# EAGLE design controller (EAGLE 6.1)
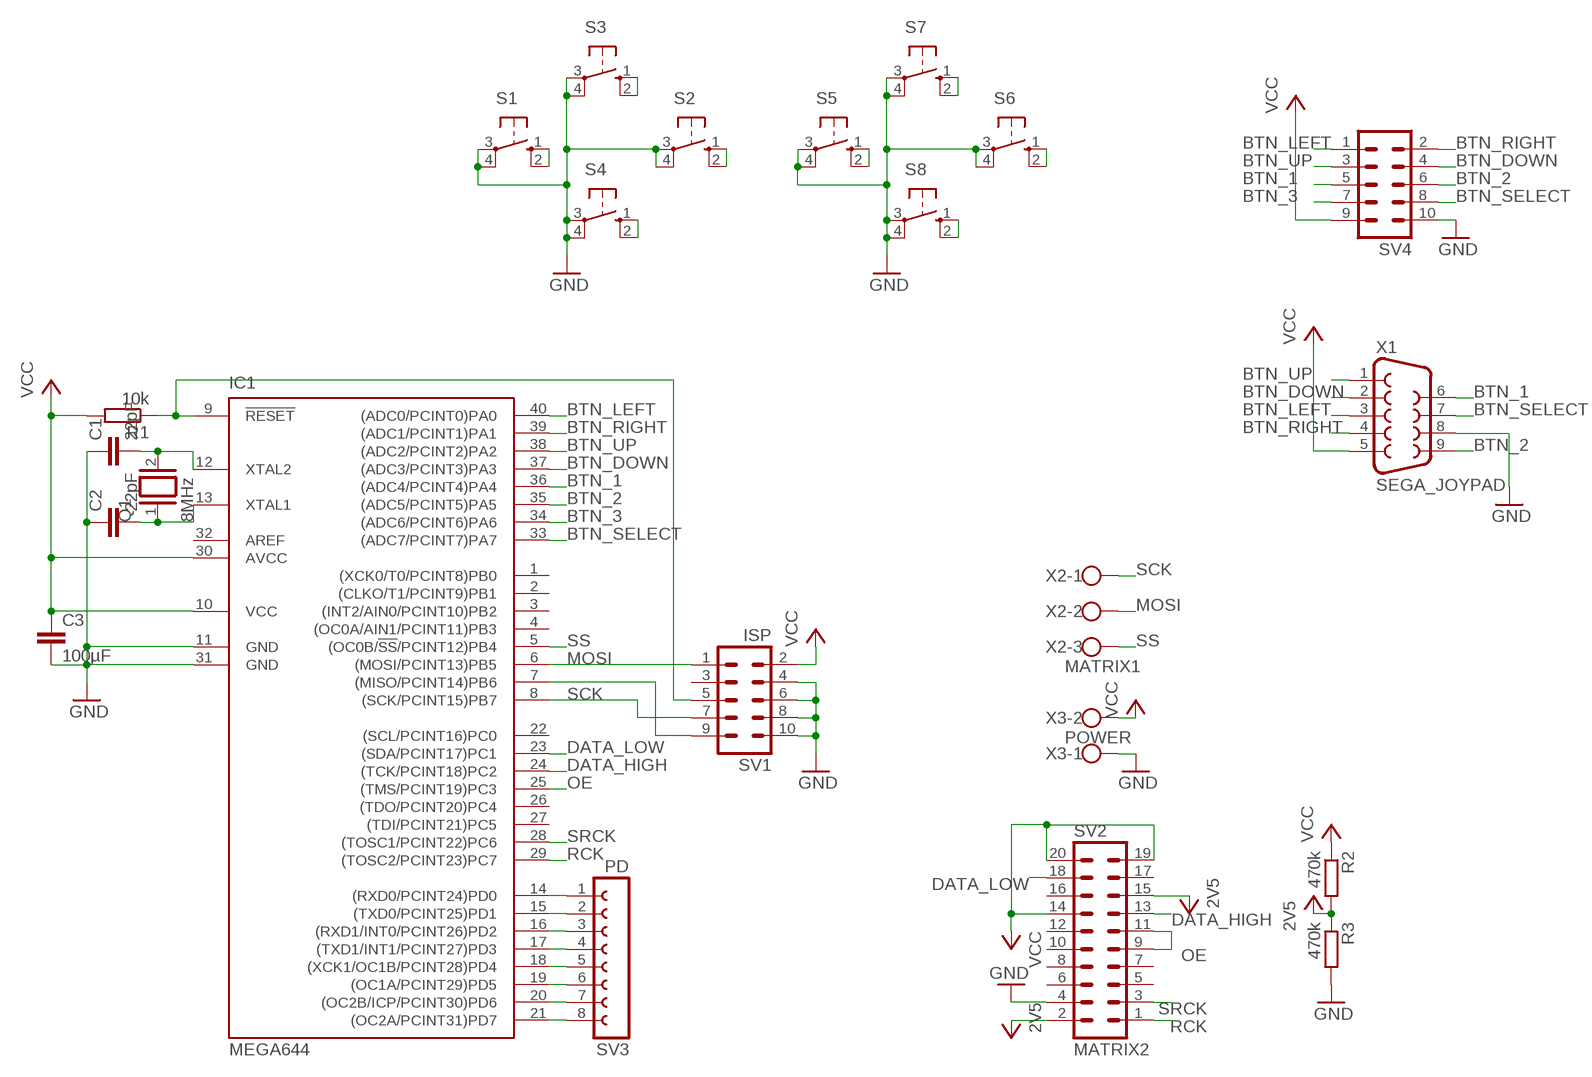
[diagram p0: schematic, sheet 1]

## Parts
C1  22pF  C-EU050-024X044  [C050-024X044]
C2  22pF  C-EU050-024X044  [C050-024X044]
C3  100µF  C-EU050-030X075  [C050-030X075]
IC1  MEGA644  MEGA164P/324P/644P-PU  [DIL40]
Q1  8MHz  XTAL/S  [QS]
R1  10k  R-EU_0207/10  [0207/10]
R2  470k  R-EU_0207/10  [0207/10]
R3  470k  R-EU_0207/10  [0207/10]
S1  10-XX  [B3F-10XX]
S2  10-XX  [B3F-10XX]
S3  10-XX  [B3F-10XX]
S4  10-XX  [B3F-10XX]
S5  10-XX  [B3F-10XX]
S6  10-XX  [B3F-10XX]
S7  10-XX  [B3F-10XX]
S8  10-XX  [B3F-10XX]
SV1  ISP  ML10  [ML10]
SV2  MATRIX2  ML20  [ML20]
SV3  PD  FE08-1  [FE08]
SV4  ML10  [ML10]
X1  SEGA_JOYPAD  F09HP  [F09HP]
X2  MATRIX1  W237-103  [W237-103]
X3  POWER  W237-102  [W237-102]

## Nets
+3V3: R2.2 R3.1 SV2.2 SV2.15 ; supply symbol labelled 2V5
BTN_1: IC1.36((ADC4/PCINT4)PA4) S7.1(S) S7.2(S1) SV4.5 X1.6
BTN_2: IC1.35((ADC5/PCINT5)PA5) S5.1(S) S5.2(S1) SV4.6 X1.9
BTN_3: IC1.34((ADC6/PCINT6)PA6) S6.1(S) S6.2(S1) SV4.7
BTN_DOWN: IC1.37((ADC3/PCINT3)PA3) S4.1(S) S4.2(S1) SV4.4 X1.2
BTN_LEFT: IC1.40((ADC0/PCINT0)PA0) S1.1(S) S1.2(S1) SV4.1 X1.3
BTN_RIGHT: IC1.39((ADC1/PCINT1)PA1) S2.1(S) S2.2(S1) SV4.2 X1.4
BTN_SELECT: IC1.33((ADC7/PCINT7)PA7) S8.1(S) S8.2(S1) SV4.8 X1.7
BTN_UP: IC1.38((ADC2/PCINT2)PA2) S3.1(S) S3.2(S1) SV4.3 X1.1
DATA_HIGH: SV2.13
DATA_LOW: SV2.18
GND: C1.1 C2.1 C3.2 IC1.11(GND) IC1.31(GND) R3.2 S1.3(P) S1.4(P1) S2.3(P) S2.4(P1) S3.3(P) S3.4(P1) S4.3(P) S4.4(P1) S5.3(P) S5.4(P1) S6.3(P) S6.4(P1) S7.3(P) S7.4(P1) S8.3(P) S8.4(P1) SV1.4 SV1.6 SV1.8 SV1.10 SV2.4 SV4.10 X1.8 X3.1
MOSI: IC1.6((MOSI/PCINT13)PB5) SV1.1 X2.2
N$2: C2.2 IC1.13(XTAL1) Q1.1
N$3: C1.2 IC1.12(XTAL2) Q1.2
N$4: IC1.9(!RESET) R1.1 SV1.5
N$5: IC1.14((RXD0/PCINT24)PD0) SV3.1
N$6: IC1.7((MISO/PCINT14)PB6) SV1.9
N$7: IC1.15((TXD0/PCINT25)PD1) SV3.2
N$8: IC1.16((RXD1/INT0/PCINT26)PD2) SV3.3
N$9: IC1.17((TXD1/INT1/PCINT27)PD3) SV3.4
N$10: IC1.18((XCK1/OC1B/PCINT28)PD4) SV3.5
N$11: IC1.19((OC1A/PCINT29)PD5) SV3.6
N$12: IC1.20((OC2B/ICP/PCINT30)PD6) SV3.7
N$13: IC1.21((OC2A/PCINT31)PD7) SV3.8
OE: SV2.9 SV2.11
RCK: IC1.29((TOSC2/PCINT23)PC7) SV2.1
SCK: IC1.8((SCK/PCINT15)PB7) SV1.7 X2.1
SRCK: IC1.28((TOSC1/PCINT22)PC6) SV2.3
SS: IC1.5((OC0B/!SS!/PCINT12)PB4) X2.3
VCC: C3.1 IC1.10(VCC) IC1.30(AVCC) R1.2 R2.1 SV1.2 SV2.14 SV2.19 SV2.20 SV4.9 X1.5 X3.2
Unconnected: IC1.1((XCK0/T0/PCINT8)PB0) IC1.2((CLKO/T1/PCINT9)PB1) IC1.3((INT2/AIN0/PCINT10)PB2) IC1.4((OC0A/AIN1/PCINT11)PB3) IC1.22((SCL/PCINT16)PC0) IC1.23((SDA/PCINT17)PC1) IC1.24((TCK/PCINT18)PC2) IC1.25((TMS/PCINT19)PC3) IC1.26((TDO/PCINT20)PC4) IC1.27((TDI/PCINT21)PC5) SV1.3 SV2.5 SV2.6 SV2.7 SV2.8 SV2.10 SV2.12 SV2.16 SV2.17

## Power pins joined to a net without a drawn wire
AREF: IC1.32(AREF)

## Library data of the parts
C1-C3 = resistor:C-EU: CAPACITOR, European symbol
IC1 = avr-5:MEGA164P/324P/644P-PU
Q1 = special:XTAL/S: CRYSTAL
R1-R3 = resistor:R-EU_: RESISTOR, European symbol
S1-S8 = switch-omron:10-XX: OMRON SWITCH; MPN: B3F-1000; OC_FARNELL: 176432; OC_NEWARK: 36M3542
SV1 = con-ml:ML10: HARTING; OC_FARNELL: unknown; OC_NEWARK: unknown
SV2 = con-ml:ML20: HARTING; OC_FARNELL: unknown; OC_NEWARK: unknown
SV3 = con-lsta:FE08-1: FEMALE HEADER; OC_FARNELL: unknown; OC_NEWARK: unknown
SV4 = con-harting-ml:ML10: HARTING; OC_FARNELL: unknown; OC_NEWARK: unknown
X1 = con-subd:F09: SUB-D; OC_FARNELL: unknown; OC_NEWARK: unknown
X2 = con-wago-500:W237-103: WAGO SCREW CLAMP; MPN: 237-103; OC_FARNELL: unknown; OC_NEWARK: 18M7116
X3 = con-wago-500:W237-102: WAGO SCREW CLAMP; MPN: 237-102; OC_FARNELL: unknown; OC_NEWARK: 70K9898

## Board
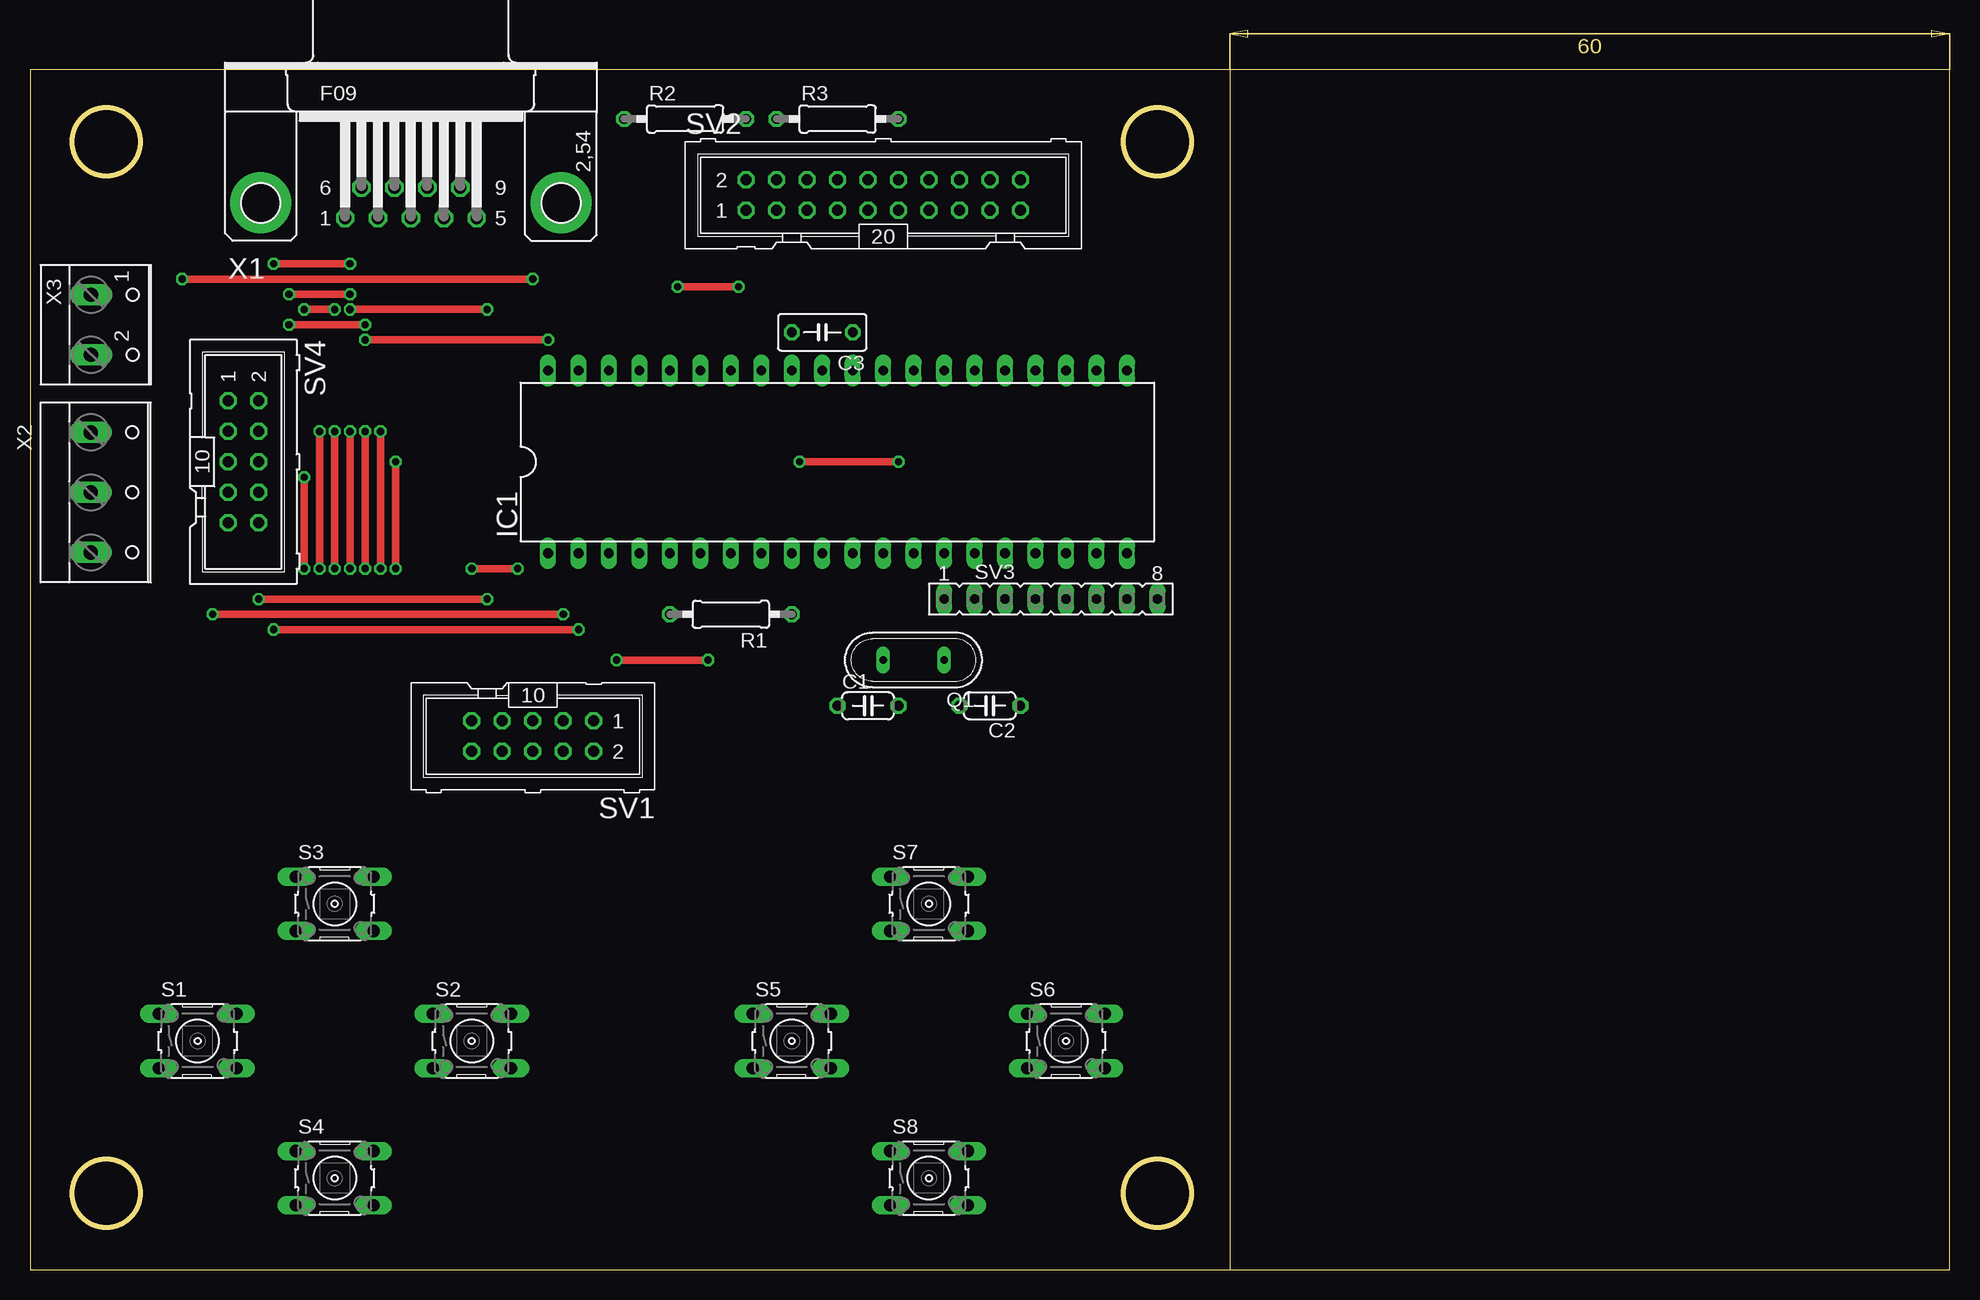
[diagram p1: board, top side]
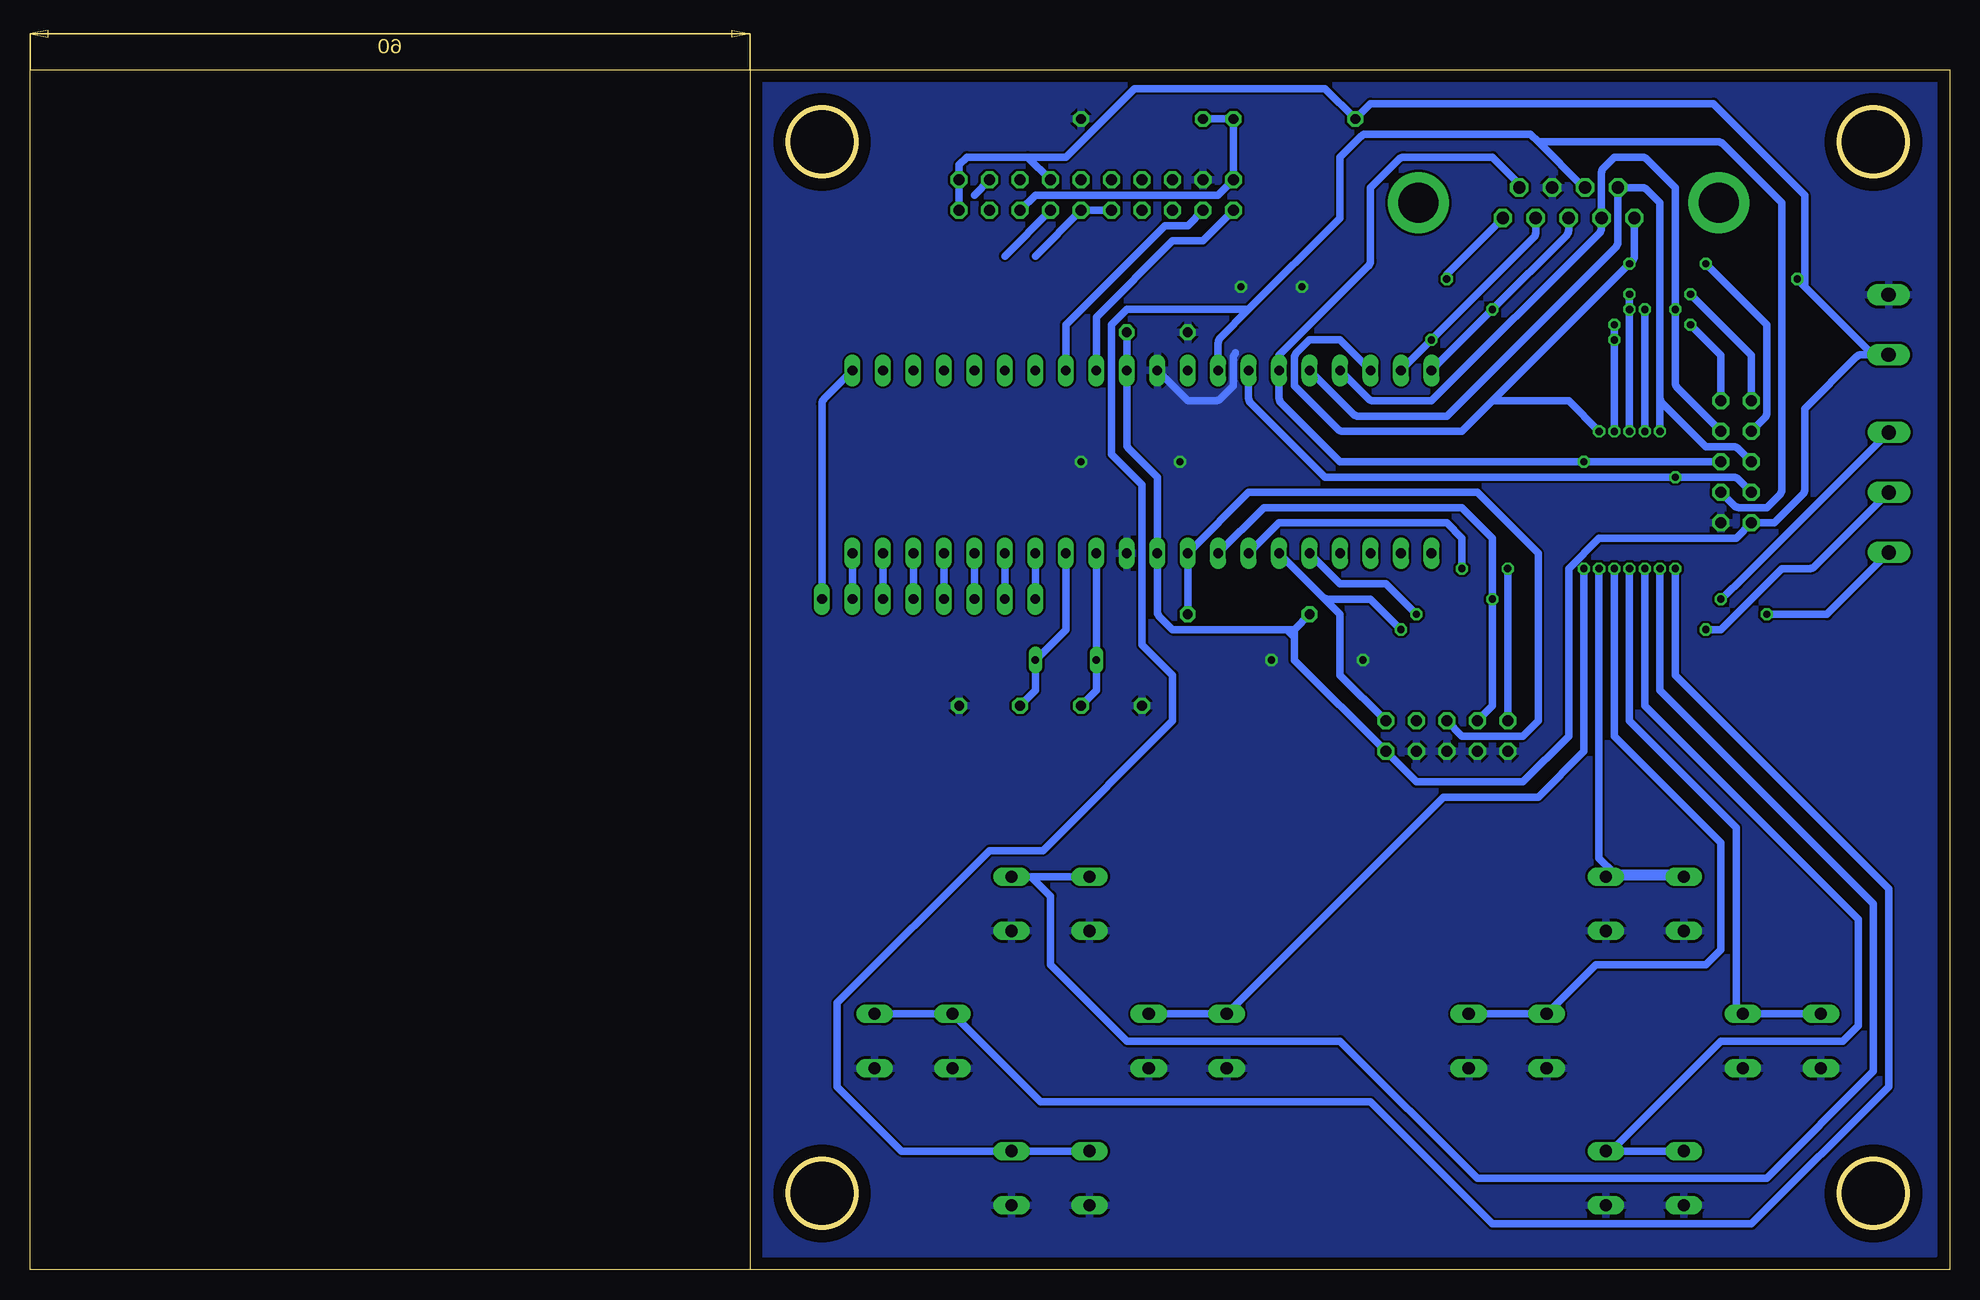
[diagram p2: board, bottom side, seen from below]

Size 160 x 100 mm. Coordinates in mm from the lower left corner, seen from the top.
Outline: 100,0 0,0 0,100 100,100
Outline: 100,0 160,0 160,100 100,100
Outline: 100,100 100,0
Outline: circle at 6.35,93.98 radius 2.84
Outline: circle at 6.35,6.35 radius 2.84
Outline: circle at 93.98,93.98 radius 2.84
Outline: circle at 93.98,6.35 radius 2.84
Copper layers (1*16): Top 0.035mm / dielectric 1.5mm / Bottom 0.035mm
Design rules: minimum track width 10mil, minimum drill 24mil, track to track 8mil, track to pad 8mil, pad to pad 8mil, via to via 8mil, smd to smd 8mil, copper to edge 40mil, drill to drill 8mil, minimum pad ring 10mil, minimum via ring 8mil, stop-mask expansion 4mil, vias tented up to drill 0mil, thermal gap 10mil

### Footprints (pad centres in the part's own frame; a part is rotated, then mirrored left to right if it is on the bottom)
C050-024X044 = drill 0.813 octagon: 1 -2.54,0; 2 2.54,0
C050-030X075 = drill 0.813 octagon: 1 -2.54,0; 2 2.54,0
DIL40 = drill 0.813 long: 1 -24.13,-7.62; 2 -21.59,-7.62; 3 -19.05,-7.62; 4 -16.51,-7.62; 5 -13.97,-7.62; 6 -11.43,-7.62; 7 -8.89,-7.62; 8 -6.35,-7.62; 9 -3.81,-7.62; 10 -1.27,-7.62; 11 1.27,-7.62; 12 3.81,-7.62; 13 6.35,-7.62; 14 8.89,-7.62; 15 11.43,-7.62; 16 13.97,-7.62; 17 16.51,-7.62; 18 19.05,-7.62; 19 21.59,-7.62; 20 24.13,-7.62; 21 24.13,7.62; 22 21.59,7.62; 23 19.05,7.62; 24 16.51,7.62; 25 13.97,7.62; 26 11.43,7.62; 27 8.89,7.62; 28 6.35,7.62; 29 3.81,7.62; 30 1.27,7.62; 31 -1.27,7.62; 32 -3.81,7.62; 33 -6.35,7.62; 34 -8.89,7.62; 35 -11.43,7.62; 36 -13.97,7.62; 37 -16.51,7.62; 38 -19.05,7.62; 39 -21.59,7.62; 40 -24.13,7.62
QS = drill 0.61 long: 1 -2.54,0; 2 2.54,0
0207/10 = drill 0.813 octagon: 1 -5.08,0; 2 5.08,0
B3F-10XX = drill 1.016 long: 1 -3.251,2.261; 2 3.251,2.261; 3 -3.251,-2.261; 4 3.251,-2.261
ML10 = drill 0.914 octagon: 1 -5.08,-1.27; 2 -5.08,1.27; 3 -2.54,-1.27; 4 -2.54,1.27; 5 0,-1.27; 6 0,1.27; 7 2.54,-1.27; 8 2.54,1.27; 9 5.08,-1.27; 10 5.08,1.27
ML20 = drill 0.914 octagon: 1 -11.43,-1.27; 2 -11.43,1.27; 3 -8.89,-1.27; 4 -8.89,1.27; 5 -6.35,-1.27; 6 -6.35,1.27; 7 -3.81,-1.27; 8 -3.81,1.27; 9 -1.27,-1.27; 10 -1.27,1.27; 11 1.27,-1.27; 12 1.27,1.27; 13 3.81,-1.27; 14 3.81,1.27; 15 6.35,-1.27; 16 6.35,1.27; 17 8.89,-1.27; 18 8.89,1.27; 19 11.43,-1.27; 20 11.43,1.27
FE08 = drill 0.813 long: 1 -8.89,0; 2 -6.35,0; 3 -3.81,0; 4 -1.27,0; 5 1.27,0; 6 3.81,0; 7 6.35,0; 8 8.89,0
F09HP = drill 1.016 octagon: 1 -5.486,-1.27; 2 -2.743,-1.27; 3 0,-1.27; 4 2.743,-1.27; 5 5.486,-1.27; 6 -4.115,1.27; 7 -1.372,1.27; 8 1.372,1.27; 9 4.115,1.27 | drill 3.302 pad 5.08: G1 -12.522,0; G2 12.522,0
W237-103 = drill 1.194 long: 1 -5,-1.29; 2 0,-1.29; 3 5,-1.29
W237-102 = drill 1.194 long: 1 -2.5,-1.27; 2 2.5,-1.27

### Placement (x,y rotation side)
C1  69.85,46.99 0 top
C2  80.01,46.99 180 top
C3  66.04,78.11 180 top
IC1  67.31,67.31 0 top
Q1  73.66,50.8 180 top
R1  58.42,54.61 180 top
R2  54.61,95.89 0 top
R3  67.31,95.89 0 top
S1  13.97,19.05 0 top
S2  36.83,19.05 0 top
S3  25.4,30.48 0 top
S4  25.4,7.62 0 top
S5  63.5,19.05 0 top
S6  86.36,19.05 0 top
S7  74.93,30.48 0 top
S8  74.93,7.62 0 top
SV1  41.91,44.45 180 top
SV2  71.12,89.53 0 top
SV3  85.09,55.88 0 top
SV4  17.78,67.31 270 top
X1  31.75,88.9 0 top
X2  6.35,64.77 270 top
X3  6.35,78.74 270 top

### Tracks (layer width: path | path; a pad name or v marks a point on that pad's centre or on a via)
+3V3
  Bottom 0.61: R3.1 R2.2 SV2.2 60.96,89.53 76.2,89.53 SV2.15
BTN_1  (via drill 0.6 pad 0.41)
  Top 0.61: v24.13,58.42 v24.13,69.85
  Bottom 0.61: S7.1 S7.2 76.56,32.74 74.93,31.11 74.93,25.4 68.58,19.05 50.8,19.05 39.37,7.62 15.24,7.62 6.35,16.51 6.35,30.48 24.13,48.26 v24.13,58.42 | IC1.36 49.72,71.31 arc-45 49.27,71.12 41.91,71.12 27.82,85.21 arc-45 27.64,85.66 X1.6 25.66,90.17 arc45 25.21,89.98 24.13,88.9 24.13,72.65 arc-45 23.94,72.2 | SV4.5 17.59,68.39 arc-45 18.04,68.58 20.32,68.58 23.94,72.2 | v24.13,69.85 24.13,72.39 23.94,72.2
BTN_2  (via drill 0.6 pad 0.41)
  Top 0.61: v30.48,58.42 v30.48,67.31
  Bottom 0.61: S5.2 S5.1 42.19,39.37 34.29,39.37 30.48,43.18 v30.48,58.42 | X1.9 35.87,90.21 arc-45 36.05,90.66 38.1,92.71 45.46,92.71 arc-45 45.91,92.52 48.26,90.17 48.26,84.08 arc45 48.45,83.63 55.88,76.2 IC1.35 55.88,72.65 arc-45 55.69,72.2 50.8,67.31 v30.48,67.31 SV4.6
BTN_3  (via drill 0.6 pad 0.41)
  Top 0.61: v22.86,58.42 v22.86,66.04
  Bottom 0.61: S6.2 S6.1 75.77,13.97 48.26,13.97 38.1,3.81 16.51,3.81 5.08,15.24 5.08,31.75 22.86,49.53 v22.86,58.42 | SV4.7 17.59,65.85 arc-45 18.04,66.04 v22.86,66.04 52.07,66.04 58.23,72.2 arc45 58.42,72.65 IC1.34
BTN_DOWN  (via drill 0.6 pad 0.41)
  Top 0.61: v25.4,58.42 v25.4,69.85 | v25.4,80.01 v22.86,80.01
  Bottom 0.61: S4.1 27.94,9.88 | 27.94,9.88 S4.2 | IC1.37 48.45,72.58 arc-45 48,72.39 43.18,72.39 29.19,86.38 arc-45 29.01,86.83 X1.2 29.01,91.38 arc45 28.82,91.83 27.94,92.71 25.66,92.71 arc45 25.21,92.52 22.86,90.17 v22.86,80.01 22.86,73.92 arc-45 22.67,73.47 SV4.4 | v25.4,58.42 25.4,46.99 7.62,29.21 7.62,20.32 8.89,19.05 19.05,19.05 27.94,10.16 27.94,9.88 | v25.4,69.85 v25.4,80.01
BTN_LEFT  (via drill 0.6 pad 0.41)
  Top 0.61: v26.67,58.42 v26.67,69.85 | v21.59,81.28 v26.67,81.28 | v38.1,80.01 v26.67,80.01
  Bottom 0.61: S1.1 S1.2 17.78,21.87 17.78,36.83 26.67,45.72 v26.67,58.42 | IC1.40 v38.1,80.01 31.94,86.17 arc-45 31.75,86.62 X1.3 | SV4.1 16.51,76.2 v21.59,81.28 | v26.67,81.28 v26.67,80.01 v26.67,69.85
BTN_RIGHT  (via drill 0.6 pad 0.41)
  Top 0.61: v21.59,78.74 v27.94,78.74 | v27.94,58.42 v27.94,69.85 | v43.18,77.47 v27.94,77.47
  Bottom 0.61: S2.2 S2.1 29.49,25.4 20.32,25.4 19.05,26.67 19.05,35.56 27.94,44.45 v27.94,58.42 | IC1.39 v43.18,77.47 34.68,85.97 arc-45 34.49,86.42 X1.4 | SV4.2 19.05,76.2 v21.59,78.74 | v27.94,69.85 v27.94,77.47 v27.94,78.74
BTN_SELECT
  Bottom 0.61: S8.1 S8.2 | 34.29,93.98 34.92,94.61 48.63,94.61 arc-45 49.08,94.43 50.8,92.71 50.8,87.63 58.42,80.01 | 34.29,93.98 30.55,90.24 arc-45 X1.7 | 58.42,80.01 60.77,77.66 arc-45 60.96,77.21 IC1.33 | SV4.8 17.97,63.69 arc-45 17.52,63.5 15.24,63.5 14.16,64.58 arc-45 13.97,65.03 13.97,88.9 18.86,93.79 arc-45 19.31,93.98 34.29,93.98 | 76.48,9.88 S8.2 | S8.2 87.35,9.88 92.71,15.24 92.71,22.23 80.01,34.92 75.56,34.92 64.77,45.72 64.77,49.53 67.31,52.07 67.31,65.41 69.85,67.94 69.85,78.74 68.58,80.01 58.42,80.01
BTN_UP  (via drill 0.6 pad 0.41)
  Top 0.61: v20.32,83.82 v26.67,83.82 | v29.21,58.42 v29.21,69.85
  Bottom 0.61: S3.2 S3.1 22.43,33.02 27.94,33.02 29.21,34.29 v29.21,58.42 | IC1.38 50.8,77.47 53.34,77.47 54.42,76.39 arc-45 54.61,75.94 54.61,73.66 50.99,70.04 arc-45 50.54,69.85 40.64,69.85 38.1,72.39 | 38.1,72.39 v26.67,83.82 26.45,84.04 arc-45 26.26,84.49 X1.1 | SV4.3 15.43,70.93 arc-45 15.24,71.38 15.24,78.74 v20.32,83.82 | v29.21,69.85 31.75,72.39 38.1,72.39
DATA_HIGH
  Bottom 0.61: 78.74,84.45 SV2.13
DATA_LOW
  Bottom 0.61: 81.28,89.53 SV2.18
GND  (via drill 0.6, 0.6 pad 0.41)
  Top 0.61: v53.98,81.92 v59.05,81.92 | v48.9,50.8 v56.52,50.8 | v64.14,67.31 v72.39,67.31
  Bottom 0.61: IC1.31 63.5,72.39 61.22,72.39 arc-45 60.77,72.58 59.69,73.66 59.69,75.94 arc45 59.5,76.39
  pour Bottom: 1.27,100.33 99.06,99.69 99.06,1.27 1.27,1.27
MOSI  (via drill 0.6 pad 0.41)
  Top 0.61: v20.32,53.34 v45.72,53.34
  Bottom 0.61: IC1.6 53.34,57.15 52.26,56.07 | 52.26,56.07 arc-45 51.81,55.88 | 51.81,55.88 48.26,55.88 v45.72,53.34 | X2.2 11.22,58.61 arc45 11.67,58.42 13.97,58.42 19.05,53.34 v20.32,53.34 | SV1.1 50.8,49.53 50.8,54.61 51.81,55.62 | 51.81,55.62 51.81,55.88 | 52.26,56.07 51.81,55.62
N$2
  Bottom 0.61: IC1.13 73.66,53.34 Q1.1 76.2,48.26 C2.2
N$3
  Bottom 0.61: IC1.12 Q1.2 71.12,48.26 C1.2
N$4
  Bottom 0.61: 63.5,59.43 R1.1 IC1.9 | 63.31,59.88 58.42,64.77 39.37,64.77 34.29,59.69 34.29,45.72 35.56,44.45 40.64,44.45 SV1.5 | 63.31,59.88 arc-45 63.5,59.43 | 63.5,59.43 IC1.9 | 63.31,59.88 IC1.9
N$5
  Bottom 0.61: SV3.1 IC1.14
N$6  (via drill 0.6 pad 0.41)
  Top 0.61: v36.83,58.42 v40.64,58.42
  Bottom 0.61: IC1.7 55.88,62.23 41.91,62.23 40.64,60.96 v40.64,58.42 | SV1.9 v36.83,58.42
N$7
  Bottom 0.61: SV3.2 IC1.15
N$8
  Bottom 0.61: SV3.3 IC1.16
N$9
  Bottom 0.61: SV3.4 IC1.17
N$10
  Bottom 0.61: SV3.5 IC1.18
N$11
  Bottom 0.61: SV3.6 IC1.19
N$12
  Bottom 0.61: SV3.7 IC1.20
N$13
  Bottom 0.61: IC1.21 93.79,72.58 arc-45 93.98,72.13 SV3.8
OE
  Bottom 0.61: 76.2,84.45 SV2.11 SV2.9
RCK
  Bottom 0.61: IC1.29 71.12,79.38 64.77,85.72 62.23,85.72 SV2.1
SCK  (via drill 0.6 pad 0.41)
  Top 0.61: v19.05,55.88 v38.1,55.88
  Bottom 0.61: IC1.8 57.15,63.5 40.64,63.5 38.1,60.96 v38.1,55.88 38.1,46.99 SV1.7 | X2.1 17.68,57.15 v19.05,55.88
SRCK
  Bottom 0.61: IC1.28 73.66,78.74 65.41,87 63.5,87 SV2.3
SS  (via drill 0.6 pad 0.41)
  Top 0.61: v15.24,54.61 v44.45,54.61
  Bottom 0.61: X2.3 10.22,54.61 v15.24,54.61 | IC1.5 50.8,57.15 46.99,57.15 v44.45,54.61
VCC  (via drill 0.6 pad 0.41)
  Top 0.61: v41.91,82.55 v12.7,82.55
  Bottom 0.61: R1.2 54.61,53.34 | X1.5 41.91,82.96 v41.91,82.55 | v12.7,82.55 12.06,81.92 | 12.06,81.92 6.39,76.24 X3.2 7.32,76.24 arc-45 7.77,76.05 12.06,71.75 12.06,65.03 arc45 12.25,64.58 14.61,62.23 SV4.9 17.78,60.96 29.21,60.96 31.75,58.42 31.75,44.45 35.56,40.64 44.45,40.64 SV1.2 54.61,50.8 54.61,52.7 | 54.61,52.7 54.61,53.34 | 55.24,53.34 64.77,53.34 65.85,54.42 arc45 66.04,54.87 IC1.10 66.04,66.04 68.39,68.39 arc45 68.58,68.84 IC1.30 C3.1 | 55.24,53.34 54.61,52.7 | 55.24,53.34 54.61,53.34 | SV2.19 SV2.20 82.55,92.08 81.92,92.71 76.83,92.71 | 12.06,81.92 12.06,89.53 19.68,97.16 48.26,97.16 R2.1 52.07,98.42 67.94,98.42 73.66,92.71 76.83,92.71 | SV2.14 76.83,92.71